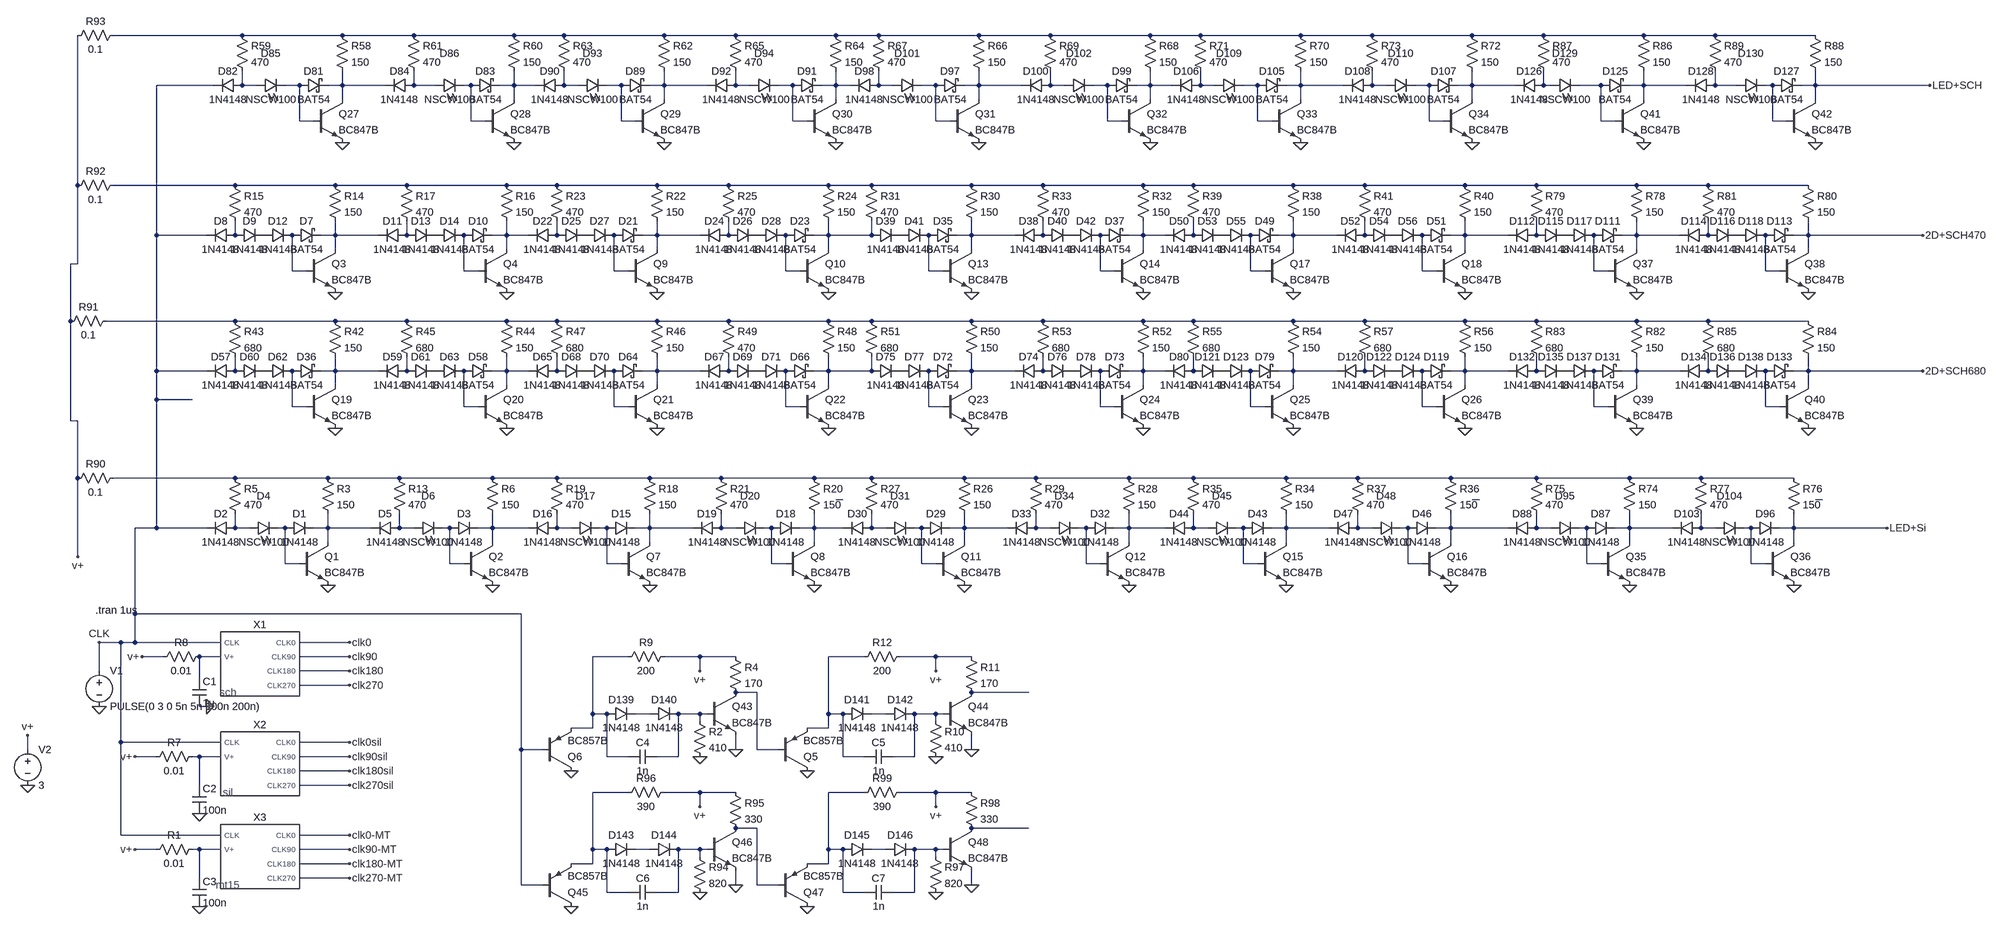
[diagram p0: schematic _QuadGen.asc]
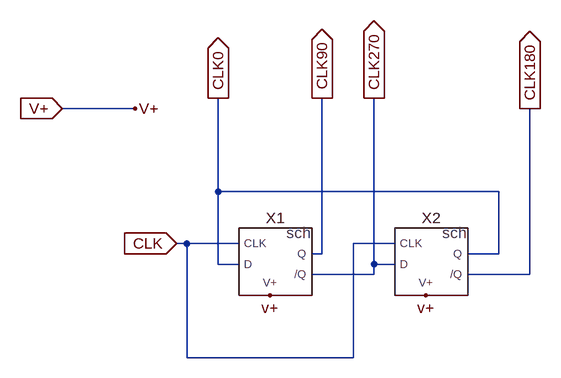
[diagram p1: sub-circuit quadgen.asc]
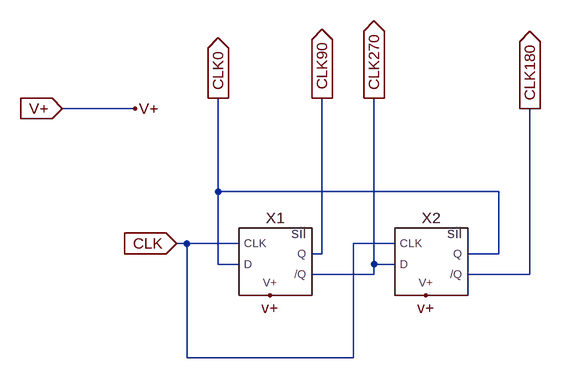
[diagram p2: sub-circuit quadgen-sil.asc]
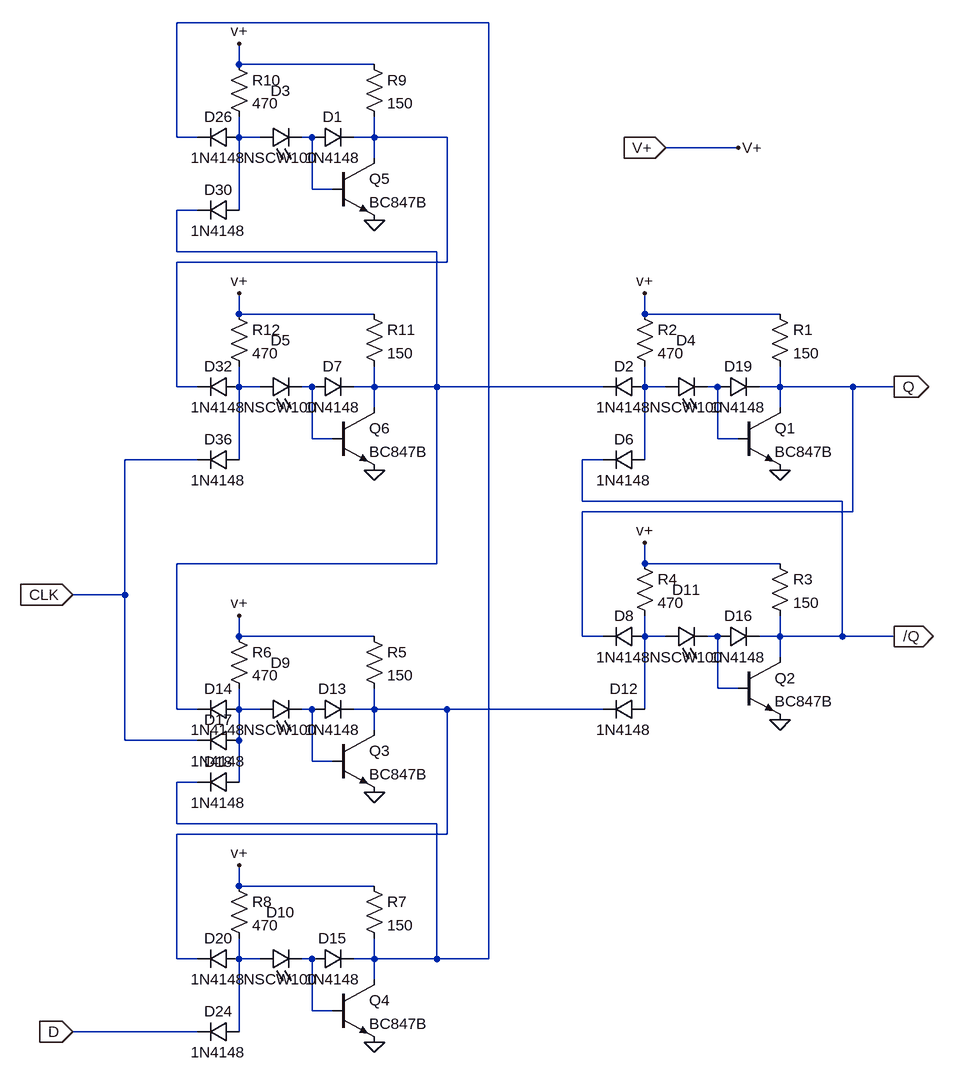
[diagram p3: sub-circuit d-flipflop-edge-sil.asc]
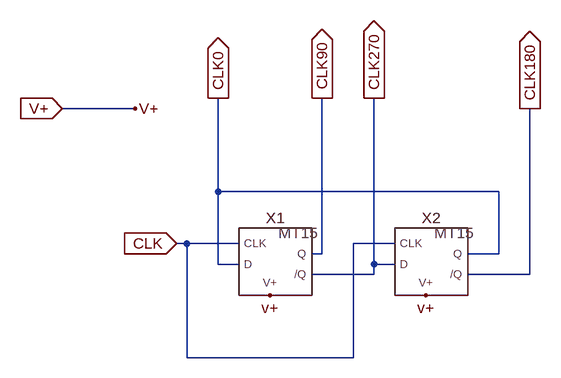
[diagram p4: sub-circuit quadgen-mt15.asc]
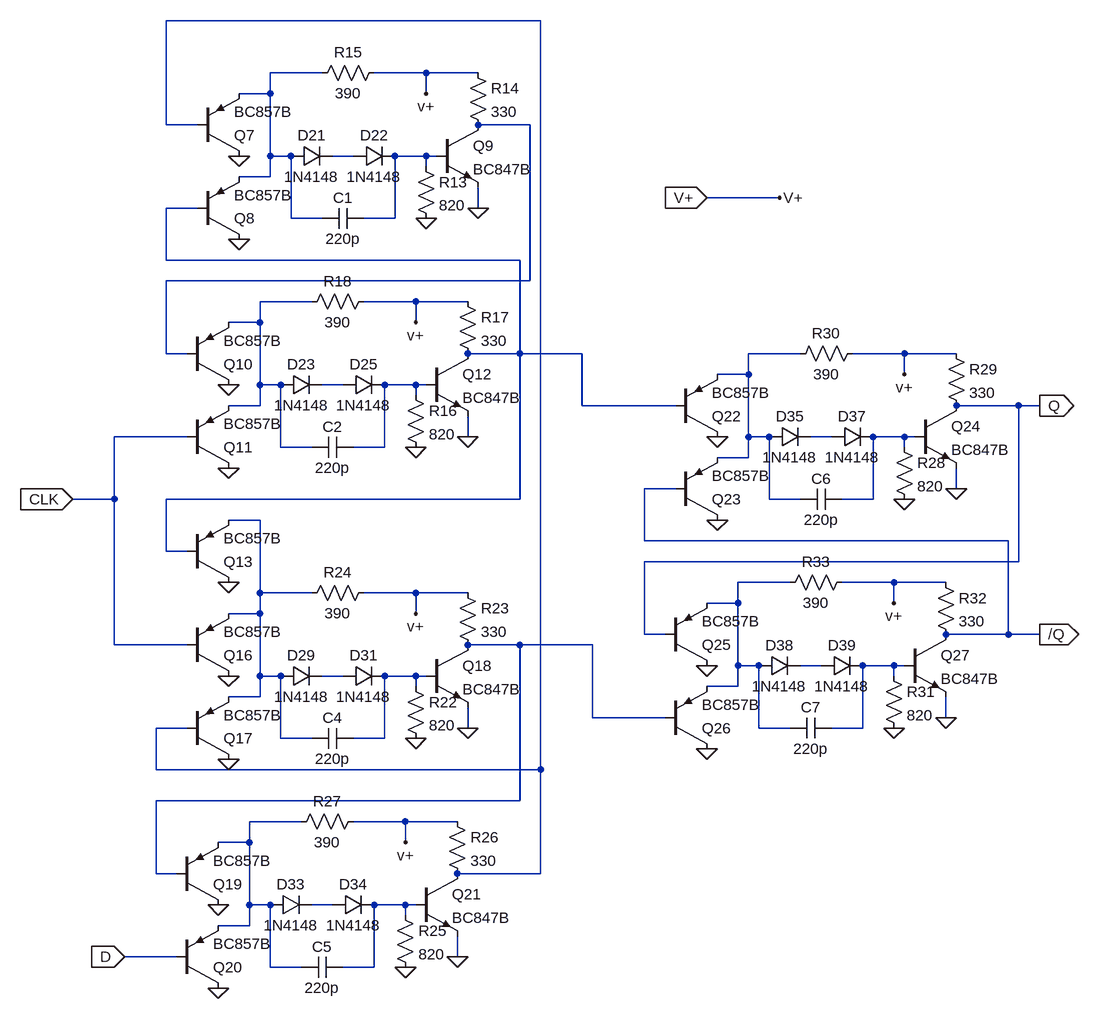
[diagram p5: sub-circuit d-flipflop-edge-mt15.asc]
* _QuadGen.asc
XX1 CLK clk0 clk180 clk270 clk90 N122 quadgen
V1 CLK 0 PULSE(0 3 0 5n 5n 100n 200n)
V2 v+ 0 3
XX2 CLK clk0sil clk180sil clk270sil clk90sil N131 quadgen-sil
R7 N131 v+ 0.01
R8 N122 v+ 0.01
Q1 N095 N094 0 0 BC847B
R3 N089 N095 150
R5 N089 N093 470
D1 N094 N095 1N4148
D2 N093 CLK 1N4148
D4 N093 N094 NSCW100
Q2 N098 N097 0 0 BC847B
R6 N089 N098 150
R13 N089 N096 470
D3 N097 N098 1N4148
D5 N096 N095 1N4148
D6 N096 N097 NSCW100
Q3 N033 N050 0 0 BC847B
R14 N031 N033 150
R15 N031 N032 470
D7 N050 N033 BAT54
D8 N032 CLK 1N4148
Q4 N035 N051 0 0 BC847B
R16 N031 N035 150
R17 N031 N034 470
D10 N051 N035 BAT54
D11 N034 N033 1N4148
D9 N032 P001 1N4148
D13 N034 P002 1N4148
D12 P001 N050 1N4148
D14 P002 N051 1N4148
Q7 N101 N100 0 0 BC847B
R18 N089 N101 150
R19 N089 N099 470
D15 N100 N101 1N4148
D16 N099 N098 1N4148
D17 N099 N100 NSCW100
Q8 N104 N103 0 0 BC847B
R20 N089 N104 150
R21 N089 N102 470
D18 N103 N104 1N4148
D19 N102 N101 1N4148
D20 N102 N103 NSCW100
Q9 N037 N052 0 0 BC847B
R22 N031 N037 150
R23 N031 N036 470
D21 N052 N037 BAT54
D22 N036 N035 1N4148
Q10 N039 N053 0 0 BC847B
R24 N031 N039 150
R25 N031 N038 470
D23 N053 N039 BAT54
D24 N038 N037 1N4148
D25 N036 P003 1N4148
D26 N038 P004 1N4148
D27 P003 N052 1N4148
D28 P004 N053 1N4148
Q11 N107 N106 0 0 BC847B
R26 N089 N107 150
R27 N089 N105 470
D29 N106 N107 1N4148
D30 N105 N104 1N4148
D31 N105 N106 NSCW100
Q12 N110 N109 0 0 BC847B
R28 N089 N110 150
R29 N089 N108 470
D32 N109 N110 1N4148
D33 N108 N107 1N4148
D34 N108 N109 NSCW100
Q13 N040 N054 0 0 BC847B
R30 N031 N040 150
R31 N031 N039 470
D35 N054 N040 BAT54
Q14 N042 N055 0 0 BC847B
R32 N031 N042 150
R33 N031 N041 470
D37 N055 N042 BAT54
D38 N041 N040 1N4148
D39 N039 P005 1N4148
D40 N041 P006 1N4148
D41 P005 N054 1N4148
D42 P006 N055 1N4148
Q15 N113 N112 0 0 BC847B
R34 N089 N113 150
R35 N089 N111 470
D43 N112 N113 1N4148
D44 N111 N110 1N4148
D45 N111 N112 NSCW100
Q16 N116 N115 0 0 BC847B
R36 N089 N116 150
R37 N089 N114 470
D46 N115 N116 1N4148
D47 N114 N113 1N4148
D48 N114 N115 NSCW100
Q17 N044 N056 0 0 BC847B
R38 N031 N044 150
R39 N031 N043 470
D49 N056 N044 BAT54
D50 N043 N042 1N4148
Q18 N046 N057 0 0 BC847B
R40 N031 N046 150
R41 N031 N045 470
D51 N057 N046 BAT54
D52 N045 N044 1N4148
D53 N043 P007 1N4148
D54 N045 P008 1N4148
D55 P007 N056 1N4148
D56 P008 N057 1N4148
Q27 N004 N003 0 0 BC847B
R58 N001 N004 150
R59 N001 N002 470
D81 N003 N004 BAT54
D82 N002 CLK 1N4148
Q28 N007 N006 0 0 BC847B
R60 N001 N007 150
R61 N001 N005 470
D83 N006 N007 BAT54
D84 N005 N004 1N4148
Q29 N010 N009 0 0 BC847B
R62 N001 N010 150
R63 N001 N008 470
D89 N009 N010 BAT54
D90 N008 N007 1N4148
Q30 N013 N012 0 0 BC847B
R64 N001 N013 150
R65 N001 N011 470
D91 N012 N013 BAT54
D92 N011 N010 1N4148
Q31 N016 N015 0 0 BC847B
R66 N001 N016 150
R67 N001 N014 470
D97 N015 N016 BAT54
D98 N014 N013 1N4148
Q32 N019 N018 0 0 BC847B
R68 N001 N019 150
R69 N001 N017 470
D99 N018 N019 BAT54
D100 N017 N016 1N4148
Q33 N022 N021 0 0 BC847B
R70 N001 N022 150
R71 N001 N020 470
D105 N021 N022 BAT54
D106 N020 N019 1N4148
Q34 N025 N024 0 0 BC847B
R72 N001 N025 150
R73 N001 N023 470
D107 N024 N025 BAT54
D108 N023 N022 1N4148
Q35 N119 N118 0 0 BC847B
R74 N089 N119 150
R75 N089 N117 470
D87 N118 N119 1N4148
D88 N117 N116 1N4148
D95 N117 N118 NSCW100
Q36 LED+Si N121 0 0 BC847B
R76 N089 LED+Si 150
R77 N089 N120 470
D96 N121 LED+Si 1N4148
D103 N120 N119 1N4148
D104 N120 N121 NSCW100
Q37 N048 N058 0 0 BC847B
R78 N031 N048 150
R79 N031 N047 470
D111 N058 N048 BAT54
D112 N047 N046 1N4148
Q38 2D+SCH470 N059 0 0 BC847B
R80 N031 2D+SCH470 150
R81 N031 N049 470
D113 N059 2D+SCH470 BAT54
D114 N049 N048 1N4148
D115 N047 P009 1N4148
D116 N049 P010 1N4148
D117 P009 N058 1N4148
D118 P010 N059 1N4148
Q41 N028 N027 0 0 BC847B
R86 N001 N028 150
R87 N001 N026 470
D125 N027 N028 BAT54
D126 N026 N025 1N4148
Q42 LED+SCH N030 0 0 BC847B
R88 N001 LED+SCH 150
R89 N001 N029 470
D127 N030 LED+SCH BAT54
D128 N029 N028 1N4148
D85 N002 N003 NSCW100
D86 N005 N006 NSCW100
D93 N008 N009 NSCW100
D94 N011 N012 NSCW100
D101 N014 N015 NSCW100
D102 N017 N018 NSCW100
D109 N020 N021 NSCW100
D110 N023 N024 NSCW100
D129 N026 N027 NSCW100
D130 N029 N030 NSCW100
R90 N089 v+ 0.1
R91 N060 v+ 0.1
R92 N031 v+ 0.1
R93 N001 v+ 0.1
Q19 N062 N079 0 0 BC847B
R42 N060 N062 150
R43 N060 N061 680
D36 N079 N062 BAT54
D57 N061 CLK 1N4148
Q20 N064 N080 0 0 BC847B
R44 N060 N064 150
R45 N060 N063 680
D58 N080 N064 BAT54
D59 N063 N062 1N4148
D60 N061 P011 1N4148
D61 N063 P012 1N4148
D62 P011 N079 1N4148
D63 P012 N080 1N4148
Q21 N066 N081 0 0 BC847B
R46 N060 N066 150
R47 N060 N065 680
D64 N081 N066 BAT54
D65 N065 N064 1N4148
Q22 N068 N082 0 0 BC847B
R48 N060 N068 150
R49 N060 N067 470
D66 N082 N068 BAT54
D67 N067 N066 1N4148
D68 N065 P013 1N4148
D69 N067 P014 1N4148
D70 P013 N081 1N4148
D71 P014 N082 1N4148
Q23 N069 N083 0 0 BC847B
R50 N060 N069 150
R51 N060 N068 680
D72 N083 N069 BAT54
Q24 N071 N084 0 0 BC847B
R52 N060 N071 150
R53 N060 N070 680
D73 N084 N071 BAT54
D74 N070 N069 1N4148
D75 N068 P015 1N4148
D76 N070 P016 1N4148
D77 P015 N083 1N4148
D78 P016 N084 1N4148
Q25 N073 N085 0 0 BC847B
R54 N060 N073 150
R55 N060 N072 680
D79 N085 N073 BAT54
D80 N072 N071 1N4148
Q26 N075 N086 0 0 BC847B
R56 N060 N075 150
R57 N060 N074 680
D119 N086 N075 BAT54
D120 N074 N073 1N4148
D121 N072 P017 1N4148
D122 N074 P018 1N4148
D123 P017 N085 1N4148
D124 P018 N086 1N4148
Q39 N077 N087 0 0 BC847B
R82 N060 N077 150
R83 N060 N076 680
D131 N087 N077 BAT54
D132 N076 N075 1N4148
Q40 2D+SCH680 N088 0 0 BC847B
R84 N060 2D+SCH680 150
R85 N060 N078 680
D133 N088 2D+SCH680 BAT54
D134 N078 N077 1N4148
D135 N076 P019 1N4148
D136 N078 P020 1N4148
D137 P019 N087 1N4148
D138 P020 N088 1N4148
C1 N122 0 1µ
C2 N131 0 100n
R1 N136 v+ 0.01
C3 N136 0 100n
XX3 CLK clk0-MT clk180-MT clk270-MT clk90-MT N136 quadgen-mt15
Q6 0 CLK N123 0 BC857B
Q43 N125 N128 0 0 BC847B
D139 N123 N127 1N4148
D140 N127 N128 1N4148
C4 N128 N123 1n
R2 N128 0 410
R4 v+ N125 170
R9 v+ N123 200
Q5 0 N125 N124 0 BC857B
Q44 N126 N130 0 0 BC847B
D141 N124 N129 1N4148
D142 N129 N130 1N4148
C5 N130 N124 1n
R10 N130 0 410
R11 v+ N126 170
R12 v+ N124 200
Q45 0 CLK N132 0 BC857B
Q46 N134 N138 0 0 BC847B
D143 N132 N137 1N4148
D144 N137 N138 1N4148
C6 N138 N132 1n
R94 N138 0 820
R95 v+ N134 330
R96 v+ N132 390
Q47 0 N134 N133 0 BC857B
Q48 N135 N140 0 0 BC847B
D145 N133 N139 1N4148
D146 N139 N140 1N4148
C7 N140 N133 1n
R97 N140 0 820
R98 v+ N135 330
R99 v+ N133 390

* block symbol definitions
.subckt quadgen CLK CLK0 CLK180 CLK270 CLK90 V+
XX1 CLK CLK0 v+ CLK270 CLK90 D-FlipFlop-Edge  ; pins CLK D V+ /Q Q
XX2 CLK CLK270 v+ CLK180 CLK0 D-FlipFlop-Edge  ; pins CLK D V+ /Q Q
.ends quadgen

.subckt quadgen-sil CLK CLK0 CLK180 CLK270 CLK90 V+
XX1 CLK CLK0 v+ CLK270 CLK90 d-flipflop-edge-sil
XX2 CLK CLK270 v+ CLK180 CLK0 d-flipflop-edge-sil
.ends quadgen-sil

.subckt d-flipflop-edge-sil CLK D V+ /Q Q
Q1 Q N009 0 0 BC847B
R1 v+ Q 150
R2 v+ N008 470
D2 N008 N005 1N4148
D6 N008 /Q 1N4148
Q2 /Q N011 0 0 BC847B
R3 v+ /Q 150
R4 v+ N010 470
D8 N010 Q 1N4148
D12 N010 N014 1N4148
Q3 N014 N013 0 0 BC847B
R5 v+ N014 150
R6 v+ N012 470
D14 N012 N005 1N4148
D17 N012 CLK 1N4148
D18 N012 N001 1N4148
Q4 N001 N016 0 0 BC847B
R7 v+ N001 150
R8 v+ N015 470
D20 N015 N014 1N4148
D24 N015 D 1N4148
Q5 N004 N003 0 0 BC847B
R9 v+ N004 150
R10 v+ N002 470
D26 N002 N001 1N4148
D30 N002 N005 1N4148
Q6 N005 N007 0 0 BC847B
R11 v+ N005 150
R12 v+ N006 470
D32 N006 N004 1N4148
D36 N006 CLK 1N4148
D3 N002 N003 NSCW100
D4 N008 N009 NSCW100
D5 N006 N007 NSCW100
D9 N012 N013 NSCW100
D10 N015 N016 NSCW100
D11 N010 N011 NSCW100
D1 N003 N004 1N4148
D7 N007 N005 1N4148
D13 N013 N014 1N4148
D15 N016 N001 1N4148
D16 N011 /Q 1N4148
D19 N009 Q 1N4148
.ends d-flipflop-edge-sil

.subckt quadgen-mt15 CLK CLK0 CLK180 CLK270 CLK90 V+
XX1 CLK CLK0 v+ CLK270 CLK90 d-flipflop-edge-mt15
XX2 CLK CLK270 v+ CLK180 CLK0 d-flipflop-edge-mt15
.ends quadgen-mt15

.subckt d-flipflop-edge-mt15 CLK D V+ /Q Q
Q16 0 CLK N013 0 BC857B
Q17 0 N001 N013 0 BC857B
Q18 N015 N019 0 0 BC847B
D29 N013 N018 1N4148
D31 N018 N019 1N4148
C4 N019 N013 220p
R22 N019 0 820
R23 V+ N015 330
R24 V+ N013 390
Q19 0 N015 N020 0 BC857B
Q20 0 D N020 0 BC857B
Q21 N001 N022 0 0 BC847B
D33 N020 N021 1N4148
D34 N021 N022 1N4148
C5 N022 N020 220p
R25 N022 0 820
R26 V+ N001 330
R27 V+ N020 390
Q22 0 N006 N008 0 BC857B
Q23 0 /Q N008 0 BC857B
Q24 Q N012 0 0 BC847B
D35 N008 N011 1N4148
D37 N011 N012 1N4148
C6 N012 N008 220p
R28 N012 0 820
R29 V+ Q 330
R30 V+ N008 390
Q25 0 Q N014 0 BC857B
Q26 0 N015 N014 0 BC857B
Q27 /Q N017 0 0 BC847B
D38 N014 N016 1N4148
D39 N016 N017 1N4148
C7 N017 N014 220p
R31 N017 0 820
R32 V+ /Q 330
R33 V+ N014 390
Q7 0 N001 N002 0 BC857B
Q8 0 N006 N002 0 BC857B
Q9 N003 N005 0 0 BC847B
D21 N002 N004 1N4148
D22 N004 N005 1N4148
C1 N005 N002 220p
R13 N005 0 820
R14 V+ N003 330
R15 V+ N002 390
Q10 0 N003 N007 0 BC857B
Q11 0 CLK N007 0 BC857B
Q12 N006 N010 0 0 BC847B
D23 N007 N009 1N4148
D25 N009 N010 1N4148
C2 N010 N007 220p
R16 N010 0 820
R17 V+ N006 330
R18 V+ N007 390
Q13 0 N006 N013 0 BC857B
.ends d-flipflop-edge-mt15

.model D D
.lib standard.dio
.model NPN NPN
.model PNP PNP
.lib standard.bjt
.tran 1us
.backanno
.end